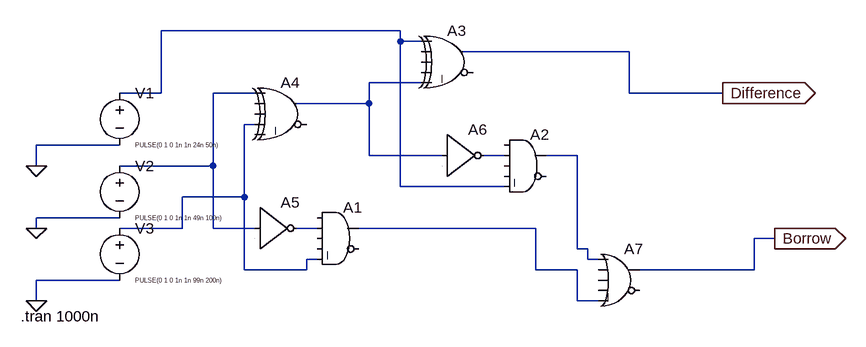
[diagram p0: schematic full_subtractor.asc]
full_subtractor.asc, the LTspice schematic file:
Version 4
SHEET 1 1152 680
WIRE 432 -64 64 -64
WIRE 432 -48 432 -64
WIRE 464 -48 432 -48
WIRE 784 -32 528 -32
WIRE 464 16 384 16
WIRE 64 32 64 -64
WIRE 64 32 0 32
WIRE 208 32 144 32
WIRE 784 32 784 -32
WIRE 928 32 784 32
WIRE 384 48 384 16
WIRE 384 48 272 48
WIRE 208 80 192 80
WIRE 0 112 -128 112
WIRE 384 128 384 48
WIRE 496 128 384 128
WIRE 592 128 560 128
WIRE 704 128 656 128
WIRE -128 144 -128 112
WIRE 144 144 144 32
WIRE 144 144 0 144
WIRE 432 176 432 -48
WIRE 592 176 432 176
WIRE 192 192 192 80
WIRE 192 192 96 192
WIRE 0 224 -128 224
WIRE -128 240 -128 224
WIRE 96 240 96 192
WIRE 96 240 0 240
WIRE 144 240 144 144
WIRE 208 240 144 240
WIRE 304 240 272 240
WIRE 640 240 368 240
WIRE 1008 256 976 256
WIRE 704 272 704 128
WIRE 720 272 704 272
WIRE 304 288 288 288
WIRE 720 288 720 272
WIRE 736 288 720 288
WIRE 192 304 192 192
WIRE 288 304 288 288
WIRE 288 304 192 304
WIRE 640 304 640 240
WIRE 704 304 640 304
WIRE 976 304 976 256
WIRE 976 304 800 304
WIRE 0 320 -128 320
WIRE -128 352 -128 320
WIRE 704 352 704 304
WIRE 736 352 704 352
FLAG -128 144 0
FLAG -128 240 0
FLAG -128 352 0
FLAG 928 32 Difference
IOPIN 928 32 Out
FLAG 1008 256 Borrow
IOPIN 1008 256 Out
SYMBOL voltage 0 16 R0
WINDOW 3 24 96 Left 0
WINDOW 123 0 0 Left 0
WINDOW 39 0 0 Left 0
SYMATTR Value PULSE(0 1 0 1n 1n 24n 50n)
SYMATTR InstName V1
SYMBOL voltage 0 128 R0
WINDOW 3 24 96 Left 0
WINDOW 123 0 0 Left 0
WINDOW 39 0 0 Left 0
SYMATTR Value PULSE(0 1 0 1n 1n 49n 100n)
SYMATTR InstName V2
SYMBOL voltage 0 224 R0
WINDOW 3 24 96 Left 0
WINDOW 123 0 0 Left 0
WINDOW 39 0 0 Left 0
SYMATTR Value PULSE(0 1 0 1n 1n 99n 200n)
SYMATTR InstName V3
SYMBOL Digital\\and 336 192 R0
SYMATTR InstName A1
SYMBOL Digital\\and 624 80 R0
SYMATTR InstName A2
SYMBOL Digital\\xor 512 -80 R0
SYMATTR InstName A3
SYMBOL Digital\\xor 256 0 R0
SYMATTR InstName A4
SYMBOL Digital\\inv 208 176 R0
SYMATTR InstName A5
SYMBOL Digital\\inv 496 64 R0
SYMATTR InstName A6
SYMBOL Digital\\or 768 256 R0
SYMATTR InstName A7
TEXT -152 376 Left 2 !.tran 1000n

The netlist it stands for:
* full_subtractor.asc
V1 N001 0 PULSE(0 1 0 1n 1n 24n 50n)
V2 N003 0 PULSE(0 1 0 1n 1n 49n 100n)
V3 N004 0 PULSE(0 1 0 1n 1n 99n 200n)
A1 0 N007 0 0 N004 0 N008 0 AND
A2 0 N005 0 0 N001 0 N006 0 AND
A3 N001 0 0 0 N002 0 Difference 0 XOR
A4 N003 0 0 N004 0 0 N002 0 XOR
A5 N003 0 0 0 0 N007 0 0 BUF
A6 N002 0 0 0 0 N005 0 0 BUF
A7 N006 0 0 0 N008 0 Borrow 0 OR
.tran 1000n
.backanno
.end